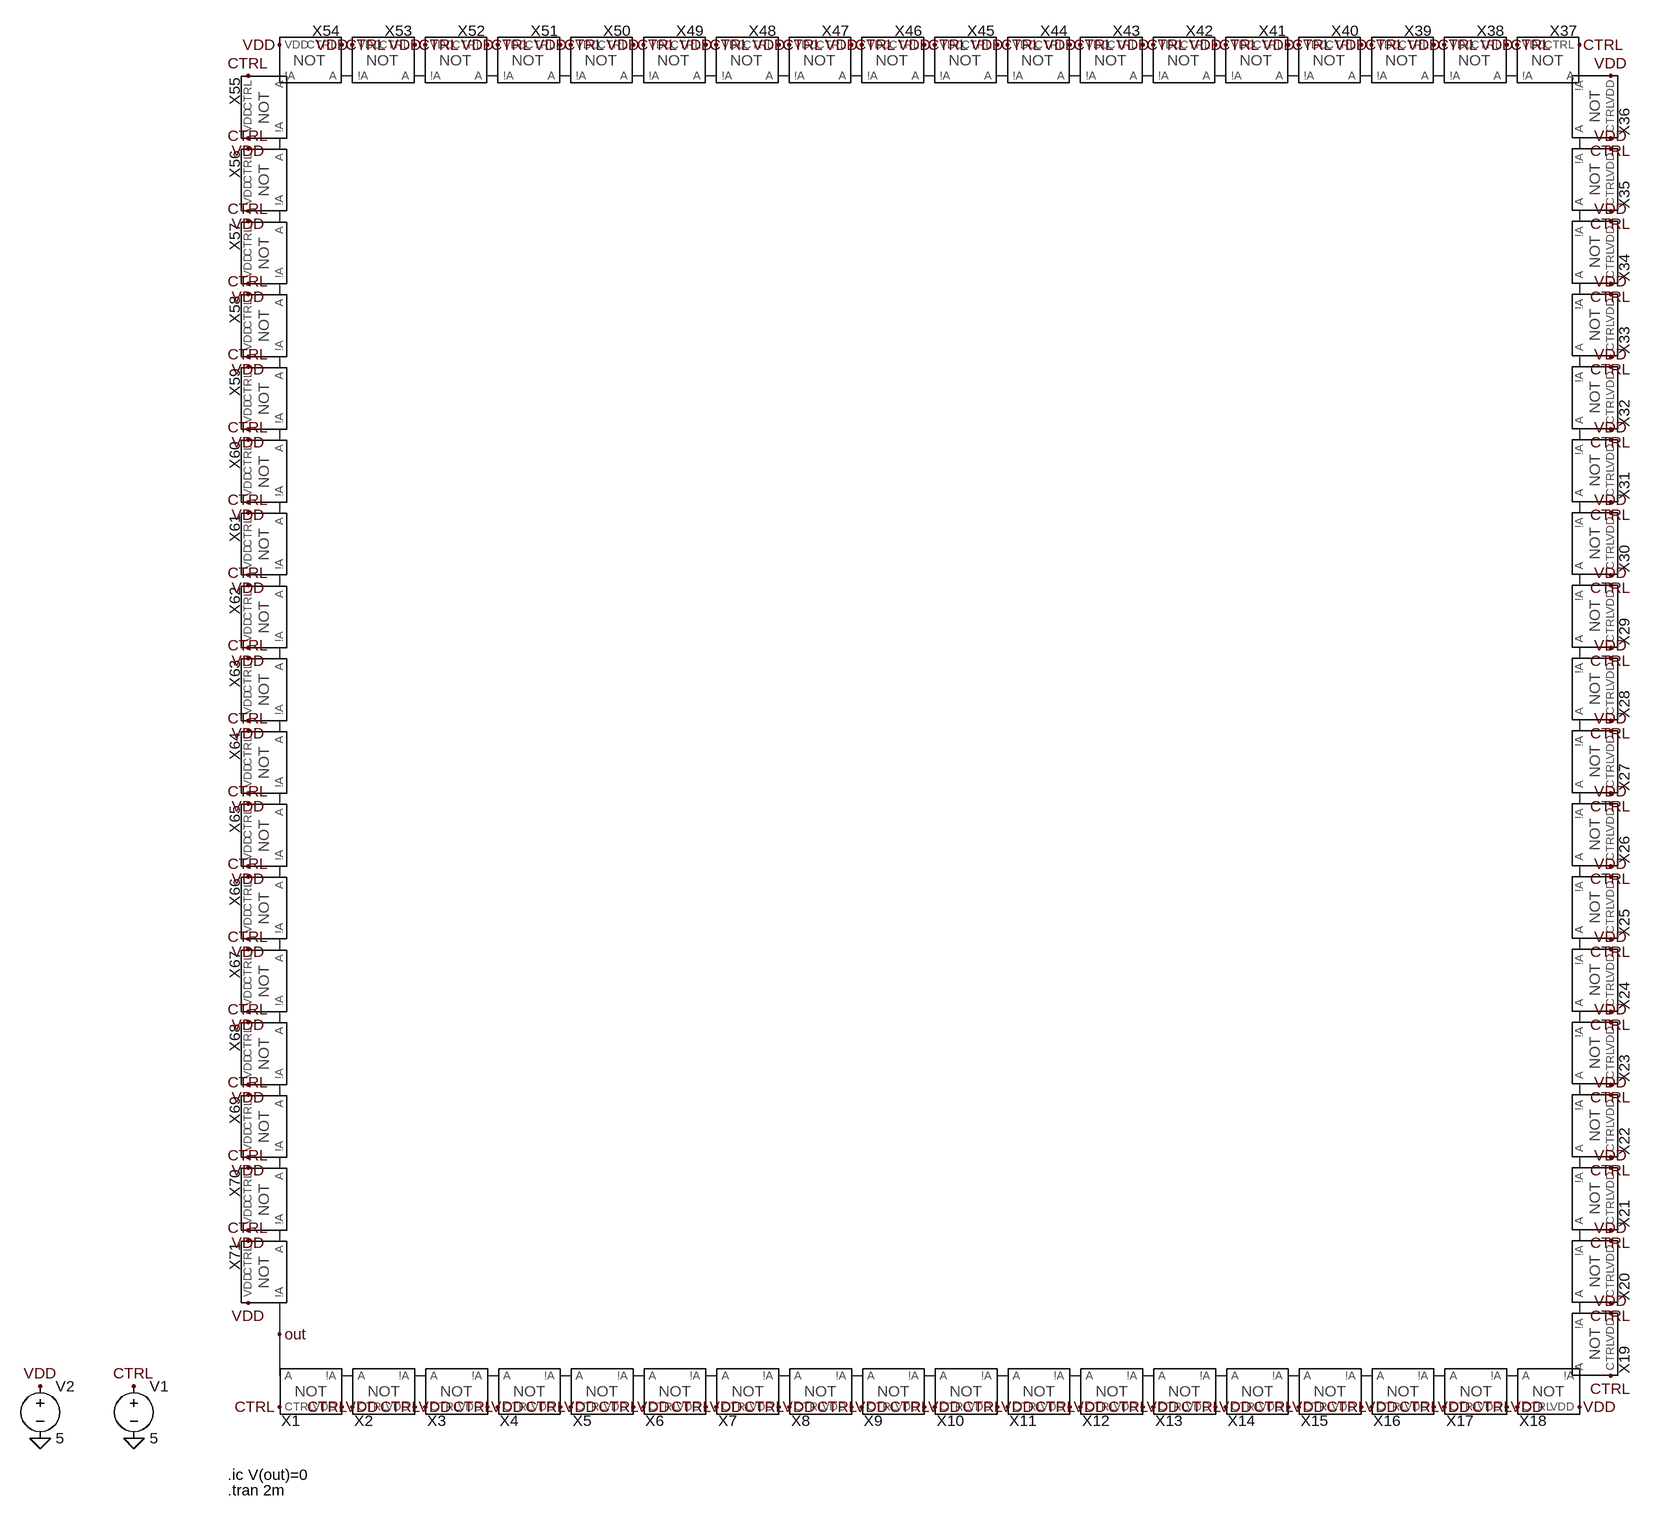
[diagram p0: schematic Ring_Occ[71].asc]
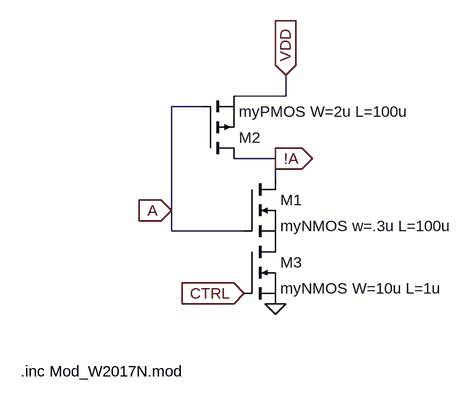
[diagram p1: sub-circuit gate_starved_inverter.asc]
Ring_Occ[71].asc, the LTspice schematic file:
Version 4
SHEET 1 2856 680
WIRE -144 -1888 -160 -1888
WIRE -32 -1888 -48 -1888
WIRE 80 -1888 64 -1888
WIRE 192 -1888 176 -1888
WIRE 304 -1888 288 -1888
WIRE 416 -1888 400 -1888
WIRE 528 -1888 512 -1888
WIRE 640 -1888 624 -1888
WIRE 752 -1888 736 -1888
WIRE 864 -1888 848 -1888
WIRE 976 -1888 960 -1888
WIRE 1088 -1888 1072 -1888
WIRE 1200 -1888 1184 -1888
WIRE 1312 -1888 1296 -1888
WIRE 1424 -1888 1408 -1888
WIRE 1536 -1888 1520 -1888
WIRE 1648 -1888 1632 -1888
WIRE -256 -1776 -256 -1792
WIRE 1744 -1776 1744 -1792
WIRE -256 -1664 -256 -1680
WIRE 1744 -1664 1744 -1680
WIRE -256 -1552 -256 -1568
WIRE 1744 -1552 1744 -1568
WIRE -256 -1440 -256 -1456
WIRE 1744 -1440 1744 -1456
WIRE -256 -1328 -256 -1344
WIRE 1744 -1328 1744 -1344
WIRE -256 -1216 -256 -1232
WIRE 1744 -1216 1744 -1232
WIRE -256 -1104 -256 -1120
WIRE 1744 -1104 1744 -1120
WIRE -256 -992 -256 -1008
WIRE 1744 -992 1744 -1008
WIRE -256 -880 -256 -896
WIRE 1744 -880 1744 -896
WIRE -256 -768 -256 -784
WIRE 1744 -768 1744 -784
WIRE -256 -656 -256 -672
WIRE 1744 -656 1744 -672
WIRE -256 -544 -256 -560
WIRE 1744 -544 1744 -560
WIRE -256 -432 -256 -448
WIRE 1744 -432 1744 -448
WIRE -256 -320 -256 -336
WIRE 1744 -320 1744 -336
WIRE -256 -208 -256 -224
WIRE 1744 -208 1744 -224
WIRE -256 -96 -256 -112
WIRE 1744 -96 1744 -112
WIRE 1744 16 1744 0
WIRE -256 48 -256 0
WIRE -256 112 -256 48
WIRE -144 112 -160 112
WIRE -32 112 -48 112
WIRE 80 112 64 112
WIRE 192 112 176 112
WIRE 304 112 288 112
WIRE 416 112 400 112
WIRE 528 112 512 112
WIRE 640 112 624 112
WIRE 752 112 736 112
WIRE 864 112 848 112
WIRE 976 112 960 112
WIRE 1088 112 1072 112
WIRE 1200 112 1184 112
WIRE 1312 112 1296 112
WIRE 1424 112 1408 112
WIRE 1536 112 1520 112
WIRE 1648 112 1632 112
FLAG -160 160 VDD
FLAG -256 160 CTRL
FLAG -48 160 VDD
FLAG -144 160 CTRL
FLAG 64 160 VDD
FLAG -32 160 CTRL
FLAG 176 160 VDD
FLAG 80 160 CTRL
FLAG 288 160 VDD
FLAG 192 160 CTRL
FLAG 400 160 VDD
FLAG 304 160 CTRL
FLAG 512 160 VDD
FLAG 416 160 CTRL
FLAG 624 160 VDD
FLAG 528 160 CTRL
FLAG 736 160 VDD
FLAG 640 160 CTRL
FLAG 848 160 VDD
FLAG 752 160 CTRL
FLAG 960 160 VDD
FLAG 864 160 CTRL
FLAG 1072 160 VDD
FLAG 976 160 CTRL
FLAG 1184 160 VDD
FLAG 1088 160 CTRL
FLAG 1296 160 VDD
FLAG 1200 160 CTRL
FLAG 1408 160 VDD
FLAG 1312 160 CTRL
FLAG 1520 160 VDD
FLAG 1424 160 CTRL
FLAG 1632 160 VDD
FLAG 1536 160 CTRL
FLAG 1744 160 VDD
FLAG 1648 160 CTRL
FLAG 1648 -1936 VDD
FLAG 1744 -1936 CTRL
FLAG 1536 -1936 VDD
FLAG 1632 -1936 CTRL
FLAG 1424 -1936 VDD
FLAG 1520 -1936 CTRL
FLAG 1312 -1936 VDD
FLAG 1408 -1936 CTRL
FLAG 1200 -1936 VDD
FLAG 1296 -1936 CTRL
FLAG 1088 -1936 VDD
FLAG 1184 -1936 CTRL
FLAG 976 -1936 VDD
FLAG 1072 -1936 CTRL
FLAG 864 -1936 VDD
FLAG 960 -1936 CTRL
FLAG 752 -1936 VDD
FLAG 848 -1936 CTRL
FLAG 640 -1936 VDD
FLAG 736 -1936 CTRL
FLAG 528 -1936 VDD
FLAG 624 -1936 CTRL
FLAG 416 -1936 VDD
FLAG 512 -1936 CTRL
FLAG 304 -1936 VDD
FLAG 400 -1936 CTRL
FLAG 192 -1936 VDD
FLAG 288 -1936 CTRL
FLAG 80 -1936 VDD
FLAG 176 -1936 CTRL
FLAG -32 -1936 VDD
FLAG 64 -1936 CTRL
FLAG -144 -1936 VDD
FLAG -48 -1936 CTRL
FLAG -256 -1936 VDD
FLAG -160 -1936 CTRL
FLAG 1792 16 VDD
FLAG 1792 112 CTRL
FLAG 1792 -96 VDD
FLAG 1792 0 CTRL
FLAG 1792 -208 VDD
FLAG 1792 -112 CTRL
FLAG 1792 -320 VDD
FLAG 1792 -224 CTRL
FLAG 1792 -432 VDD
FLAG 1792 -336 CTRL
FLAG 1792 -544 VDD
FLAG 1792 -448 CTRL
FLAG 1792 -656 VDD
FLAG 1792 -560 CTRL
FLAG 1792 -768 VDD
FLAG 1792 -672 CTRL
FLAG 1792 -880 VDD
FLAG 1792 -784 CTRL
FLAG 1792 -992 VDD
FLAG 1792 -896 CTRL
FLAG 1792 -1104 VDD
FLAG 1792 -1008 CTRL
FLAG 1792 -1216 VDD
FLAG 1792 -1120 CTRL
FLAG 1792 -1328 VDD
FLAG 1792 -1232 CTRL
FLAG 1792 -1440 VDD
FLAG 1792 -1344 CTRL
FLAG 1792 -1552 VDD
FLAG 1792 -1456 CTRL
FLAG 1792 -1664 VDD
FLAG 1792 -1568 CTRL
FLAG 1792 -1776 VDD
FLAG 1792 -1680 CTRL
FLAG 1792 -1888 VDD
FLAG 1792 -1792 CTRL
FLAG -304 -1792 VDD
FLAG -304 -1888 CTRL
FLAG -304 -1680 VDD
FLAG -304 -1776 CTRL
FLAG -304 -1568 VDD
FLAG -304 -1664 CTRL
FLAG -304 -1456 VDD
FLAG -304 -1552 CTRL
FLAG -304 -1344 VDD
FLAG -304 -1440 CTRL
FLAG -304 -1232 VDD
FLAG -304 -1328 CTRL
FLAG -304 -1120 VDD
FLAG -304 -1216 CTRL
FLAG -304 -1008 VDD
FLAG -304 -1104 CTRL
FLAG -304 -896 VDD
FLAG -304 -992 CTRL
FLAG -304 -784 VDD
FLAG -304 -880 CTRL
FLAG -304 -672 VDD
FLAG -304 -768 CTRL
FLAG -304 -560 VDD
FLAG -304 -656 CTRL
FLAG -304 -448 VDD
FLAG -304 -544 CTRL
FLAG -304 -336 VDD
FLAG -304 -432 CTRL
FLAG -304 -224 VDD
FLAG -304 -320 CTRL
FLAG -304 -112 VDD
FLAG -304 -208 CTRL
FLAG -304 0 VDD
FLAG -304 -96 CTRL
FLAG -480 208 0
FLAG -480 128 CTRL
FLAG -256 48 out
FLAG -624 208 0
FLAG -624 128 VDD
SYMBOL Gate_Starved_Inverter -208 144 R0
SYMATTR InstName X1
SYMBOL Gate_Starved_Inverter -96 144 R0
SYMATTR InstName X2
SYMBOL Gate_Starved_Inverter 16 144 R0
SYMATTR InstName X3
SYMBOL Gate_Starved_Inverter 128 144 R0
SYMATTR InstName X4
SYMBOL Gate_Starved_Inverter 240 144 R0
SYMATTR InstName X5
SYMBOL Gate_Starved_Inverter 352 144 R0
SYMATTR InstName X6
SYMBOL Gate_Starved_Inverter 464 144 R0
SYMATTR InstName X7
SYMBOL Gate_Starved_Inverter 576 144 R0
SYMATTR InstName X8
SYMBOL Gate_Starved_Inverter 688 144 R0
SYMATTR InstName X9
SYMBOL Gate_Starved_Inverter 800 144 R0
SYMATTR InstName X10
SYMBOL Gate_Starved_Inverter 912 144 R0
SYMATTR InstName X11
SYMBOL Gate_Starved_Inverter 1024 144 R0
SYMATTR InstName X12
SYMBOL Gate_Starved_Inverter 1136 144 R0
SYMATTR InstName X13
SYMBOL Gate_Starved_Inverter 1248 144 R0
SYMATTR InstName X14
SYMBOL Gate_Starved_Inverter 1360 144 R0
SYMATTR InstName X15
SYMBOL Gate_Starved_Inverter 1472 144 R0
SYMATTR InstName X16
SYMBOL Gate_Starved_Inverter 1584 144 R0
SYMATTR InstName X17
SYMBOL Gate_Starved_Inverter 1696 144 R0
SYMATTR InstName X18
SYMBOL Gate_Starved_Inverter 1696 -1920 R180
SYMATTR InstName X37
SYMBOL Gate_Starved_Inverter 1584 -1920 R180
SYMATTR InstName X38
SYMBOL Gate_Starved_Inverter 1472 -1920 R180
SYMATTR InstName X39
SYMBOL Gate_Starved_Inverter 1360 -1920 R180
SYMATTR InstName X40
SYMBOL Gate_Starved_Inverter 1248 -1920 R180
SYMATTR InstName X41
SYMBOL Gate_Starved_Inverter 1136 -1920 R180
SYMATTR InstName X42
SYMBOL Gate_Starved_Inverter 1024 -1920 R180
SYMATTR InstName X43
SYMBOL Gate_Starved_Inverter 912 -1920 R180
SYMATTR InstName X44
SYMBOL Gate_Starved_Inverter 800 -1920 R180
SYMATTR InstName X45
SYMBOL Gate_Starved_Inverter 688 -1920 R180
SYMATTR InstName X46
SYMBOL Gate_Starved_Inverter 576 -1920 R180
SYMATTR InstName X47
SYMBOL Gate_Starved_Inverter 464 -1920 R180
SYMATTR InstName X48
SYMBOL Gate_Starved_Inverter 352 -1920 R180
SYMATTR InstName X49
SYMBOL Gate_Starved_Inverter 240 -1920 R180
SYMATTR InstName X50
SYMBOL Gate_Starved_Inverter 128 -1920 R180
SYMATTR InstName X51
SYMBOL Gate_Starved_Inverter 16 -1920 R180
SYMATTR InstName X52
SYMBOL Gate_Starved_Inverter -96 -1920 R180
SYMATTR InstName X53
SYMBOL Gate_Starved_Inverter -208 -1920 R180
SYMATTR InstName X54
SYMBOL Gate_Starved_Inverter 1776 64 R270
SYMATTR InstName X19
SYMBOL Gate_Starved_Inverter 1776 -48 R270
SYMATTR InstName X20
SYMBOL Gate_Starved_Inverter 1776 -160 R270
SYMATTR InstName X21
SYMBOL Gate_Starved_Inverter 1776 -272 R270
SYMATTR InstName X22
SYMBOL Gate_Starved_Inverter 1776 -384 R270
SYMATTR InstName X23
SYMBOL Gate_Starved_Inverter 1776 -496 R270
SYMATTR InstName X24
SYMBOL Gate_Starved_Inverter 1776 -608 R270
SYMATTR InstName X25
SYMBOL Gate_Starved_Inverter 1776 -720 R270
SYMATTR InstName X26
SYMBOL Gate_Starved_Inverter 1776 -832 R270
SYMATTR InstName X27
SYMBOL Gate_Starved_Inverter 1776 -944 R270
SYMATTR InstName X28
SYMBOL Gate_Starved_Inverter 1776 -1056 R270
SYMATTR InstName X29
SYMBOL Gate_Starved_Inverter 1776 -1168 R270
SYMATTR InstName X30
SYMBOL Gate_Starved_Inverter 1776 -1280 R270
SYMATTR InstName X31
SYMBOL Gate_Starved_Inverter 1776 -1392 R270
SYMATTR InstName X32
SYMBOL Gate_Starved_Inverter 1776 -1504 R270
SYMATTR InstName X33
SYMBOL Gate_Starved_Inverter 1776 -1616 R270
SYMATTR InstName X34
SYMBOL Gate_Starved_Inverter 1776 -1728 R270
SYMATTR InstName X35
SYMBOL Gate_Starved_Inverter 1776 -1840 R270
SYMATTR InstName X36
SYMBOL Gate_Starved_Inverter -288 -1840 R90
SYMATTR InstName X55
SYMBOL Gate_Starved_Inverter -288 -1728 R90
SYMATTR InstName X56
SYMBOL Gate_Starved_Inverter -288 -1616 R90
SYMATTR InstName X57
SYMBOL Gate_Starved_Inverter -288 -1504 R90
SYMATTR InstName X58
SYMBOL Gate_Starved_Inverter -288 -1392 R90
SYMATTR InstName X59
SYMBOL Gate_Starved_Inverter -288 -1280 R90
SYMATTR InstName X60
SYMBOL Gate_Starved_Inverter -288 -1168 R90
SYMATTR InstName X61
SYMBOL Gate_Starved_Inverter -288 -1056 R90
SYMATTR InstName X62
SYMBOL Gate_Starved_Inverter -288 -944 R90
SYMATTR InstName X63
SYMBOL Gate_Starved_Inverter -288 -832 R90
SYMATTR InstName X64
SYMBOL Gate_Starved_Inverter -288 -720 R90
SYMATTR InstName X65
SYMBOL Gate_Starved_Inverter -288 -608 R90
SYMATTR InstName X66
SYMBOL Gate_Starved_Inverter -288 -496 R90
SYMATTR InstName X67
SYMBOL Gate_Starved_Inverter -288 -384 R90
SYMATTR InstName X68
SYMBOL Gate_Starved_Inverter -288 -272 R90
SYMATTR InstName X69
SYMBOL Gate_Starved_Inverter -288 -160 R90
SYMATTR InstName X70
SYMBOL Gate_Starved_Inverter -288 -48 R90
SYMATTR InstName X71
SYMBOL voltage -480 112 R0
WINDOW 123 0 0 Left 2
WINDOW 39 0 0 Left 2
SYMATTR InstName V1
SYMATTR Value 5
SYMBOL voltage -624 112 R0
WINDOW 123 0 0 Left 2
WINDOW 39 0 0 Left 2
SYMATTR InstName V2
SYMATTR Value 5
TEXT -336 288 Left 2 !.tran 2m
TEXT -336 264 Left 2 !.ic V(out)=0

gate_starved_inverter.asc, the sub-circuit schematic file:
Version 4
SHEET 1 880 680
WIRE 64 -112 64 -144
WIRE 64 -112 -16 -112
WIRE -64 -96 -112 -96
WIRE 48 -16 -16 -16
WIRE 48 16 48 -16
WIRE -112 64 -112 -96
WIRE -112 96 -112 64
WIRE 0 96 -112 96
FLAG -112 64 A
IOPIN -112 64 In
FLAG 48 -16 !A
IOPIN 48 -16 Out
FLAG 64 -144 VDD
IOPIN 64 -144 In
FLAG 48 208 0
FLAG 0 192 CTRL
IOPIN 0 192 In
SYMBOL nmos 0 16 R0
SYMATTR InstName M1
SYMATTR Value myNMOS w=.3u L=100u
SYMBOL pmos -64 -16 M180
SYMATTR InstName M2
SYMATTR Value myPMOS W=2u L=100u
SYMBOL nmos 0 112 R0
SYMATTR InstName M3
SYMATTR Value myNMOS W=10u L=1u
TEXT -344 312 Left 2 !.inc Mod_W2017N.mod

The netlist it stands for:
* Ring_Occ[71].asc
XX1 out VDD N051 CTRL gate_starved_inverter
XX2 N051 VDD N052 CTRL gate_starved_inverter
XX3 N052 VDD N053 CTRL gate_starved_inverter
XX4 N053 VDD N054 CTRL gate_starved_inverter
XX5 N054 VDD N055 CTRL gate_starved_inverter
XX6 N055 VDD N056 CTRL gate_starved_inverter
XX7 N056 VDD N057 CTRL gate_starved_inverter
XX8 N057 VDD N058 CTRL gate_starved_inverter
XX9 N058 VDD N059 CTRL gate_starved_inverter
XX10 N059 VDD N060 CTRL gate_starved_inverter
XX11 N060 VDD N061 CTRL gate_starved_inverter
XX12 N061 VDD N062 CTRL gate_starved_inverter
XX13 N062 VDD N063 CTRL gate_starved_inverter
XX14 N063 VDD N064 CTRL gate_starved_inverter
XX15 N064 VDD N065 CTRL gate_starved_inverter
XX16 N065 VDD N066 CTRL gate_starved_inverter
XX17 N066 VDD N067 CTRL gate_starved_inverter
XX18 N067 VDD P001 CTRL gate_starved_inverter
XX37 P002 VDD N017 CTRL gate_starved_inverter
XX38 N017 VDD N016 CTRL gate_starved_inverter
XX39 N016 VDD N015 CTRL gate_starved_inverter
XX40 N015 VDD N014 CTRL gate_starved_inverter
XX41 N014 VDD N013 CTRL gate_starved_inverter
XX42 N013 VDD N012 CTRL gate_starved_inverter
XX43 N012 VDD N011 CTRL gate_starved_inverter
XX44 N011 VDD N010 CTRL gate_starved_inverter
XX45 N010 VDD N009 CTRL gate_starved_inverter
XX46 N009 VDD N008 CTRL gate_starved_inverter
XX47 N008 VDD N007 CTRL gate_starved_inverter
XX48 N007 VDD N006 CTRL gate_starved_inverter
XX49 N006 VDD N005 CTRL gate_starved_inverter
XX50 N005 VDD N004 CTRL gate_starved_inverter
XX51 N004 VDD N003 CTRL gate_starved_inverter
XX52 N003 VDD N002 CTRL gate_starved_inverter
XX53 N002 VDD N001 CTRL gate_starved_inverter
XX54 N001 VDD P003 CTRL gate_starved_inverter
XX19 P001 VDD N050 CTRL gate_starved_inverter
XX20 N050 VDD N049 CTRL gate_starved_inverter
XX21 N049 VDD N047 CTRL gate_starved_inverter
XX22 N047 VDD N045 CTRL gate_starved_inverter
XX23 N045 VDD N043 CTRL gate_starved_inverter
XX24 N043 VDD N041 CTRL gate_starved_inverter
XX25 N041 VDD N039 CTRL gate_starved_inverter
XX26 N039 VDD N037 CTRL gate_starved_inverter
XX27 N037 VDD N035 CTRL gate_starved_inverter
XX28 N035 VDD N033 CTRL gate_starved_inverter
XX29 N033 VDD N031 CTRL gate_starved_inverter
XX30 N031 VDD N029 CTRL gate_starved_inverter
XX31 N029 VDD N027 CTRL gate_starved_inverter
XX32 N027 VDD N025 CTRL gate_starved_inverter
XX33 N025 VDD N023 CTRL gate_starved_inverter
XX34 N023 VDD N021 CTRL gate_starved_inverter
XX35 N021 VDD N019 CTRL gate_starved_inverter
XX36 N019 VDD P002 CTRL gate_starved_inverter
XX55 P003 VDD N018 CTRL gate_starved_inverter
XX56 N018 VDD N020 CTRL gate_starved_inverter
XX57 N020 VDD N022 CTRL gate_starved_inverter
XX58 N022 VDD N024 CTRL gate_starved_inverter
XX59 N024 VDD N026 CTRL gate_starved_inverter
XX60 N026 VDD N028 CTRL gate_starved_inverter
XX61 N028 VDD N030 CTRL gate_starved_inverter
XX62 N030 VDD N032 CTRL gate_starved_inverter
XX63 N032 VDD N034 CTRL gate_starved_inverter
XX64 N034 VDD N036 CTRL gate_starved_inverter
XX65 N036 VDD N038 CTRL gate_starved_inverter
XX66 N038 VDD N040 CTRL gate_starved_inverter
XX67 N040 VDD N042 CTRL gate_starved_inverter
XX68 N042 VDD N044 CTRL gate_starved_inverter
XX69 N044 VDD N046 CTRL gate_starved_inverter
XX70 N046 VDD N048 CTRL gate_starved_inverter
XX71 N048 VDD out CTRL gate_starved_inverter
V1 CTRL 0 5
V2 VDD 0 5

* block symbol definitions
.subckt gate_starved_inverter A VDD !A CTRL
M1 !A A P001 P001 myNMOS w=.3u L=100u
M2 !A A VDD VDD myPMOS W=2u L=100u
M3 P001 CTRL 0 0 myNMOS W=10u L=1u
.inc Mod_W2017N.mod
.ends gate_starved_inverter

.model NMOS NMOS
.model PMOS PMOS
.lib standard.mos
.tran 2m
.ic V(out)=0
.backanno
.end